# Altium schematic sheet 12-sdcard.SchDoc: SDCard
size Letter; DrawnBy: J. Brinton; Engineer: J. Brinton; Revision: 1; SheetNumber: 12; SheetTotal: 14
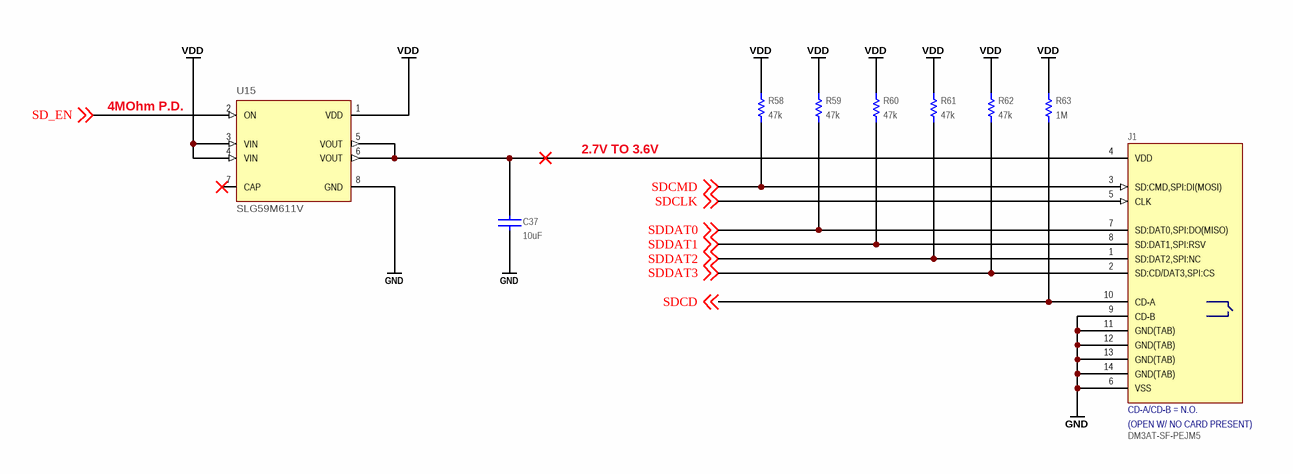
[diagram p0: 12-sdcard.SchDoc]

## Parts
C37  value 10uF  [CAPC160X80X90L20N]  (hidden comment: ZRB18AR61E106ME01L)
J1  DM3AT-SF-PEJM5  [DM3AT-SF-PEJM5]
R58  value 47k  [RESC2012X70N]  (hidden comment: ERJ-6ENF4702V)
R59  value 47k  [RESC2012X70N]  (hidden comment: ERJ-6ENF4702V)
R60  value 47k  [RESC2012X70N]  (hidden comment: ERJ-6ENF4702V)
R61  value 47k  [RESC2012X70N]  (hidden comment: ERJ-6ENF4702V)
R62  value 47k  [RESC2012X70N]  (hidden comment: ERJ-6ENF4702V)
R63  value 1M  [RESC2012X70N]  (hidden comment: ERJ-6ENF1004V)
U15  SLG59M611V  [DFN200X150X80-8N]

## Nets
GND: C37.1 J1.6(VSS) J1.9(CD-B) J1.11(GND(TAB)) J1.12(GND(TAB)) J1.13(GND(TAB)) J1.14(GND(TAB)) U15.8(GND)
VDD: R58.2 R59.2 R60.2 R61.2 R62.2 R63.2 U15.1(VDD) U15.3(VIN) U15.4(VIN)
SD_EN: U15.2(ON) ; off-sheet SD_EN
SDCD: J1.10(CD-A) R63.1 ; off-sheet SDCD
SDCLK: J1.5(CLK) ; off-sheet SDCLK
SDCMD: J1.3(SD:CMD,SPI:DI(MOSI)) R58.1 ; off-sheet SDCMD
SDDAT0: J1.7(SD:DAT0,SPI:DO(MISO)) R59.1 ; off-sheet SDDAT0
SDDAT1: J1.8(SD:DAT1,SPI:RSV) R60.1 ; off-sheet SDDAT1
SDDAT2: J1.1(SD:DAT2,SPI:NC) R61.1 ; off-sheet SDDAT2
SDDAT3: J1.2(SD:CD/DAT3,SPI:CS) R62.1 ; off-sheet SDDAT3
NetC37_2: C37.2 J1.4(VDD) U15.5(VOUT) U15.6(VOUT)

Not connected (* = marked no-connect by the designer): U15 7(CAP)*

## Notes on the sheet
- 4MOhm P.D.
- 2.7V TO 3.6V
- Designed By:
- Title
- Engineer
- Revision
- Drawn By
- Date
- Sheet
- of
- (in symbol DM3AT-SF-PEJM5) CD-A/CD-B = N.O.; (OPEN W/ NO CARD PRESENT)

## Library data of the parts
C37 = CAP 0603: Ceramic Capacitor 10uF ±20% 25V X5R 0603; Manufacturer: Murata; Tr: -55:85; Manufacturer P/N: ZRB18AR61E106ME01L; Voltage: 25V; Package: 0603; Tolerance: ±20%
J1 = DM3AT-SF-PEJM5: Micro SD Card Connector, R/A; Manufacturer: Hirose; Manufacturer P/N: DM3AT-SF-PEJM5
R58-R62 = RES 0402: Thick Film Resistor 47k ±1% 0805; Manufacturer: Panasonic; Tr: -55:155; Package: 0805; Manufacturer P/N: ERJ-6ENF4702V; Tolerance: ±1%
R63 = RES 0402: Thick Film Resistor 1M ±1% 0805; Manufacturer: Panasonic; Tr: -55:155; Package: 0805; Manufacturer P/N: ERJ-6ENF1004V; Tolerance: ±1%
U15 = SLG59M611V: High-Side Load Switch; Manufacturer: Silego; Package: WFDFN-8 Silego; Manufacturer P/N: SLG59M611V